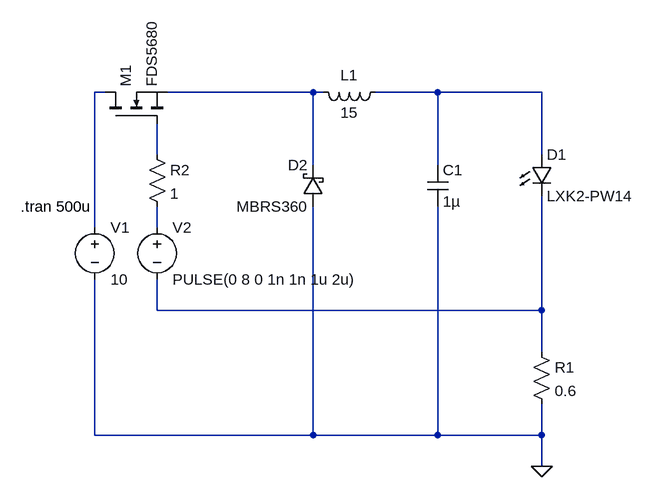
[diagram p0: schematic buck-without-cap.asc]
buck-without-cap.asc, the LTspice schematic file:
Version 4
SHEET 1 880 680
WIRE -128 -112 -144 -112
WIRE 192 -112 -32 -112
WIRE 208 -112 192 -112
WIRE 384 -112 288 -112
WIRE 544 -112 384 -112
WIRE -48 -16 -48 -64
WIRE 544 -16 544 -112
WIRE 192 0 192 -112
WIRE 384 0 384 -112
WIRE -144 96 -144 -112
WIRE -48 96 -48 64
WIRE -48 224 -48 176
WIRE 544 224 544 48
WIRE 544 224 -48 224
WIRE 544 288 544 224
WIRE -144 416 -144 176
WIRE 192 416 192 64
WIRE 192 416 -144 416
WIRE 384 416 384 64
WIRE 384 416 192 416
WIRE 544 416 544 368
WIRE 544 416 384 416
WIRE 544 464 544 416
FLAG 544 464 0
SYMBOL voltage -144 80 R0
WINDOW 123 0 0 Left 2
WINDOW 39 0 0 Left 2
SYMATTR InstName V1
SYMATTR Value 10
SYMBOL voltage -48 80 R0
WINDOW 123 0 0 Left 2
WINDOW 39 0 0 Left 2
SYMATTR InstName V2
SYMATTR Value PULSE(0 8 0 1n 1n 1u 2u)
SYMBOL ind 304 -128 R90
WINDOW 0 5 56 VBottom 2
WINDOW 3 32 56 VTop 2
SYMATTR InstName L1
SYMATTR Value 15
SYMATTR SpiceLine Rser=170m
SYMBOL LED 528 -16 R0
SYMATTR InstName D1
SYMATTR Value LXK2-PW14
SYMATTR Description Diode
SYMATTR Type diode
SYMBOL res 528 272 R0
SYMATTR InstName R1
SYMATTR Value 0.6
SYMBOL nmos -128 -64 R270
SYMATTR InstName M1
SYMATTR Value FDS5680
SYMBOL schottky 208 64 R180
WINDOW 0 24 64 Left 2
WINDOW 3 24 0 Left 2
SYMATTR InstName D2
SYMATTR Value MBRS360
SYMATTR Description Diode
SYMATTR Type diode
SYMBOL res -64 -32 R0
SYMATTR InstName R2
SYMATTR Value 1
SYMBOL cap 368 0 R0
SYMATTR InstName C1
SYMATTR Value 1µ
SYMATTR SpiceLine Rser=3m
TEXT -258 64 Left 2 !.tran 500u

The netlist it stands for:
* buck-without-cap.asc
V1 N001 0 10
V2 N005 N006 PULSE(0 8 0 1n 1n 1u 2u)
L1 N003 N002 15 Rser=170m
D1 N003 N006 LXK2-PW14
R1 N006 0 0.6
M1 N001 N004 N002 N002 FDS5680
D2 0 N002 MBRS360
R2 N004 N005 1
C1 N003 0 1µ Rser=3m
.model D D
.lib standard.dio
.model NMOS NMOS
.model PMOS PMOS
.lib standard.mos
.tran 500u
.backanno
.end